# Altium schematic sheet S2_UserInterface.SchDoc
size A4
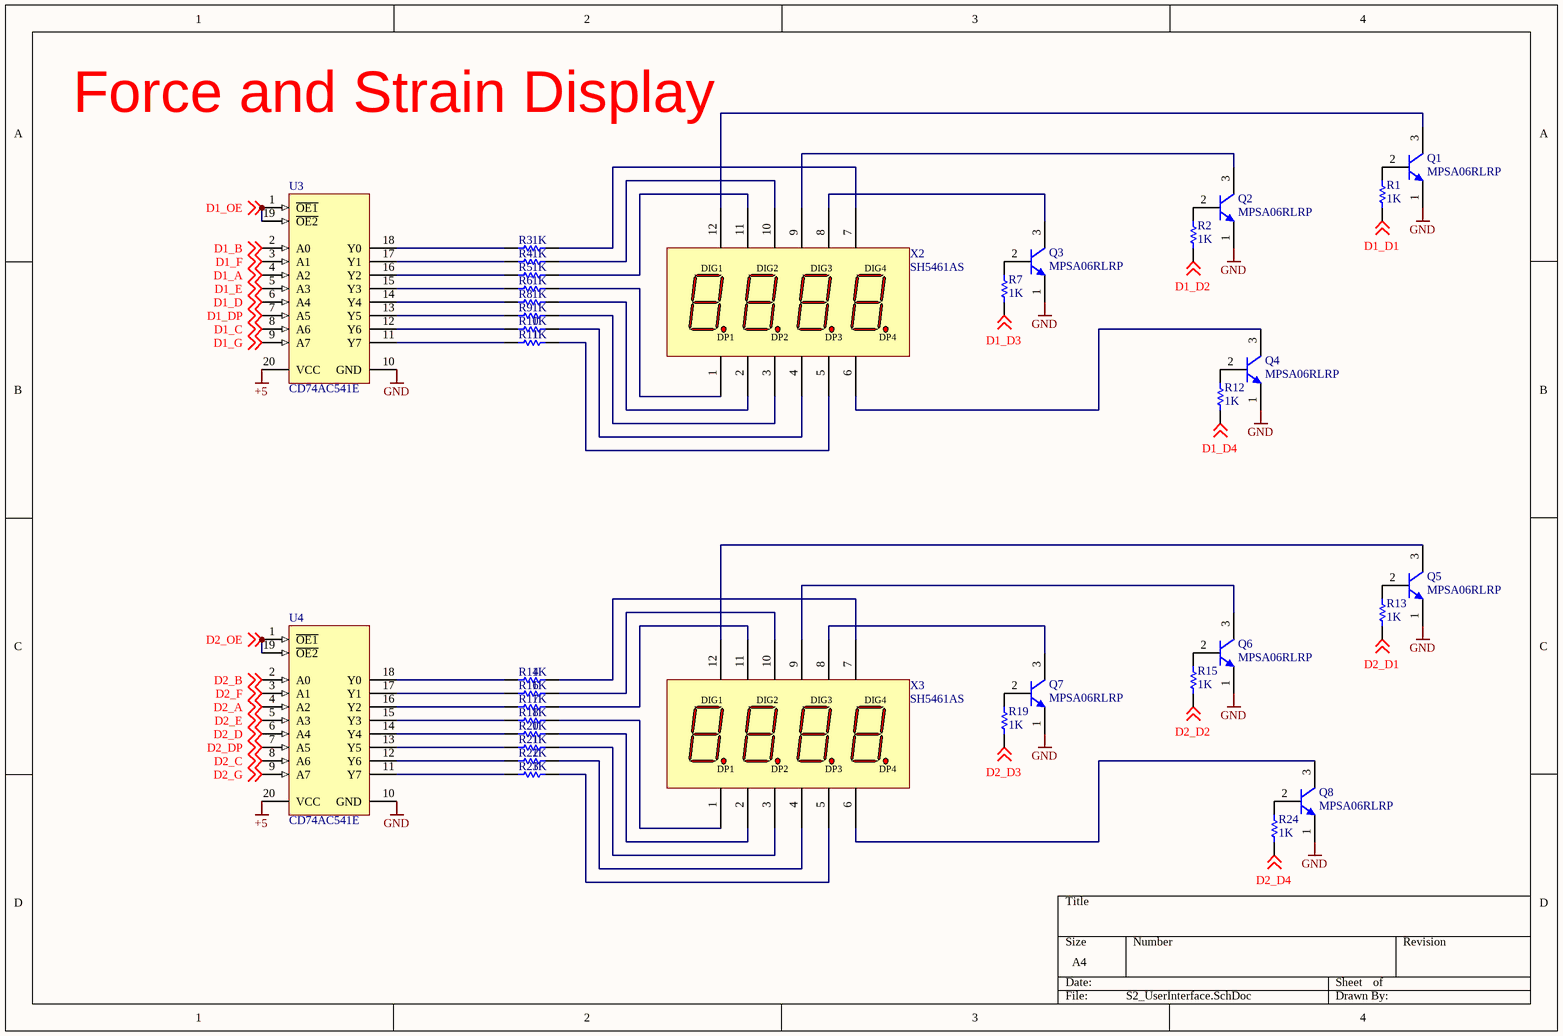
[diagram p0: S2_UserInterface.SchDoc]

## Parts
Q1  MPSA06RLRP  [ONSC-TO-92-3-29-11_AM_BL]
Q2  MPSA06RLRP  [ONSC-TO-92-3-29-11_AM_BL]
Q3  MPSA06RLRP  [ONSC-TO-92-3-29-11_AM_BL]
Q4  MPSA06RLRP  [ONSC-TO-92-3-29-11_AM_BL]
Q5  MPSA06RLRP  [ONSC-TO-92-3-29-11_AM_BL]
Q6  MPSA06RLRP  [ONSC-TO-92-3-29-11_AM_BL]
Q7  MPSA06RLRP  [ONSC-TO-92-3-29-11_AM_BL]
Q8  MPSA06RLRP  [ONSC-TO-92-3-29-11_AM_BL]
R1  value 1K  [AXIAL-0.3-3D]  (hidden comment: Res1)
R2  value 1K  [AXIAL-0.3-3D]  (hidden comment: Res1)
R3  value 1K  [AXIAL-0.3-3D]  (hidden comment: Res1)
R4  value 1K  [AXIAL-0.3-3D]  (hidden comment: Res1)
R5  value 1K  [AXIAL-0.3-3D]  (hidden comment: Res1)
R6  value 1K  [AXIAL-0.3-3D]  (hidden comment: Res1)
R7  value 1K  [AXIAL-0.3-3D]  (hidden comment: Res1)
R8  value 1K  [AXIAL-0.3-3D]  (hidden comment: Res1)
R9  value 1K  [AXIAL-0.3-3D]  (hidden comment: Res1)
R10  value 1K  [AXIAL-0.3-3D]  (hidden comment: Res1)
R11  value 1K  [AXIAL-0.3-3D]  (hidden comment: Res1)
R12  value 1K  [AXIAL-0.3-3D]  (hidden comment: Res1)
R13  value 1K  [AXIAL-0.3-3D]  (hidden comment: Res1)
R14  value 1K  [AXIAL-0.3-3D]  (hidden comment: Res1)
R15  value 1K  [AXIAL-0.3-3D]  (hidden comment: Res1)
R16  value 1K  [AXIAL-0.3-3D]  (hidden comment: Res1)
R17  value 1K  [AXIAL-0.3-3D]  (hidden comment: Res1)
R18  value 1K  [AXIAL-0.3-3D]  (hidden comment: Res1)
R19  value 1K  [AXIAL-0.3-3D]  (hidden comment: Res1)
R20  value 1K  [AXIAL-0.3-3D]  (hidden comment: Res1)
R21  value 1K  [AXIAL-0.3-3D]  (hidden comment: Res1)
R22  value 1K  [AXIAL-0.3-3D]  (hidden comment: Res1)
R23  value 1K  [AXIAL-0.3-3D]  (hidden comment: Res1)
R24  value 1K  [AXIAL-0.3-3D]  (hidden comment: Res1)
U3  CD74AC541E  [N0020A]
U4  CD74AC541E  [N0020A]
X2  SH5461AS  [4x7Seg]
X3  SH5461AS  [4x7Seg]

## Nets
+5: U3.20(VCC) U4.20(VCC)
GND: Q1.1(E) Q2.1(E) Q3.1(E) Q4.1(E) Q5.1(E) Q6.1(E) Q7.1(E) Q8.1(E) U3.10(GND) U4.10(GND)
D1_A: U3.4(A2) ; off-sheet D1_A
D1_B: U3.2(A0) ; off-sheet D1_B
D1_C: U3.8(A6) ; off-sheet D1_C
D1_D: U3.6(A4) ; off-sheet D1_D
D1_D1: R1.1 ; off-sheet D1_D1
D1_D2: R2.1 ; off-sheet D1_D2
D1_D3: R7.1 ; off-sheet D1_D3
D1_D4: R12.1 ; off-sheet D1_D4
D1_DP: U3.7(A5) ; off-sheet D1_DP
D1_E: U3.5(A3) ; off-sheet D1_E
D1_F: U3.3(A1) ; off-sheet D1_F
D1_G: U3.9(A7) ; off-sheet D1_G
D1_OE: U3.1(~{OE1}) U3.19(~{OE2}) ; off-sheet D1_OE
D2_A: U4.4(A2) ; off-sheet D2_A
D2_B: U4.2(A0) ; off-sheet D2_B
D2_C: U4.8(A6) ; off-sheet D2_C
D2_D: U4.6(A4) ; off-sheet D2_D
D2_D1: R13.1 ; off-sheet D2_D1
D2_D2: R15.1 ; off-sheet D2_D2
D2_D3: R19.1 ; off-sheet D2_D3
D2_D4: R24.1 ; off-sheet D2_D4
D2_DP: U4.7(A5) ; off-sheet D2_DP
D2_E: U4.5(A3) ; off-sheet D2_E
D2_F: U4.3(A1) ; off-sheet D2_F
D2_G: U4.9(A7) ; off-sheet D2_G
D2_OE: U4.1(~{OE1}) U4.19(~{OE2}) ; off-sheet D2_OE
NetQ1_2: Q1.2(B) R1.2
NetQ1_3: Q1.3(C) X2.12
NetQ2_2: Q2.2(B) R2.2
NetQ2_3: Q2.3(C) X2.9
NetQ3_2: Q3.2(B) R7.2
NetQ3_3: Q3.3(C) X2.8
NetQ4_2: Q4.2(B) R12.2
NetQ4_3: Q4.3(C) X2.6
NetQ5_2: Q5.2(B) R13.2
NetQ5_3: Q5.3(C) X3.12
NetQ6_2: Q6.2(B) R15.2
NetQ6_3: Q6.3(C) X3.9
NetQ7_2: Q7.2(B) R19.2
NetQ7_3: Q7.3(C) X3.8
NetQ8_2: Q8.2(B) R24.2
NetQ8_3: Q8.3(C) X3.6
NetR3_1: R3.1 X2.7
NetR3_2: R3.2 U3.18(Y0)
NetR4_1: R4.1 X2.10
NetR4_2: R4.2 U3.17(Y1)
NetR5_1: R5.1 X2.11
NetR5_2: R5.2 U3.16(Y2)
NetR6_1: R6.1 X2.1
NetR6_2: R6.2 U3.15(Y3)
NetR8_1: R8.1 X2.2
NetR8_2: R8.2 U3.14(Y4)
NetR9_1: R9.1 X2.3
NetR9_2: R9.2 U3.13(Y5)
NetR10_1: R10.1 X2.4
NetR10_2: R10.2 U3.12(Y6)
NetR11_1: R11.1 X2.5
NetR11_2: R11.2 U3.11(Y7)
NetR14_1: R14.1 X3.7
NetR14_2: R14.2 U4.18(Y0)
NetR16_1: R16.1 X3.10
NetR16_2: R16.2 U4.17(Y1)
NetR17_1: R17.1 X3.11
NetR17_2: R17.2 U4.16(Y2)
NetR18_1: R18.1 X3.1
NetR18_2: R18.2 U4.15(Y3)
NetR20_1: R20.1 X3.2
NetR20_2: R20.2 U4.14(Y4)
NetR21_1: R21.1 X3.3
NetR21_2: R21.2 U4.13(Y5)
NetR22_1: R22.1 X3.4
NetR22_2: R22.2 U4.12(Y6)
NetR23_1: R23.1 X3.5
NetR23_2: R23.2 U4.11(Y7)

## Notes on the sheet
- Force and Strain Display
- (in symbol 4x7Seg) DIG1; DIG2; DIG3; DIG4; DP1; DP2; DP3; DP4

## Library data of the parts
Q1-Q8 = CMP-1048-01505-1: 80 V, 0.5 A, Amplifier Transistor, NPN Transistor, 3-Pin TO-92, Ammo Box; Manufacturer: On Semiconductor; fT Min (MHz): 100; IC Continuous (A): 0.5; Note1: 0; ComponentLink3Description: Package Specification; PackageDescription: 3-Pin Transistor Outline, Body 4.825 x 3.685 mm, Pitch 1.27 mm; DatasheetVersion: Rev. 3; Polarity: NPN; Packing: Ammo Box; PartNumber: MPSA06RLRP; PackageVersion: Rev. AM; ComponentLink2URL: http://www.onsemi.cn/pub_link/Collateral/MPSA05-D.PDF; PackageReference: TO-92-3-29-11_AM_BL; ComponentLink2Description: Datasheet; Mounting Technology: Through Hole; ComponentLink1URL: http://www.onsemi.com/; ComponentLink3URL: http://www.onsemi.com/pub_link/Collateral/MAC97-D.PDF; ComponentLink1Description: Manufacturer URL; RoHS: FALSE
R1-R24 = Res1: Resistor; Published: 8-Jun-2000; LatestRevisionDate: 17-Jul-2002; LatestRevisionNote: Re-released for DXP Platform.; PackageReference: AXIAL-0.3; Publisher: Altium Limited; PackageDescription: Axial Device, Thru-Hole; 2 Leads; 0.3 in Pin Spacing
U3 U4 = CMP-0440-00981-2: Non-Inverting Octal Buffer/Line Drivers with 3-State Outputs, N0020A, TUBE; Manufacturer: Texas Instruments; F @ Nom Voltage(Max)(Mhz): 60; ICC @ Nom Voltage(Max)(mA): 0.16; VCC(Max)(V): 5.5; Rating: Catalog; Voltage(Nom)(V): 1.5,3.3,5; VCC(Min)(V): 1.5; tpd @ Nom Voltage(Max)(ns): 77,8.6,6.2; Output Type: CMOS; Bits(#): 8; Operating Temperature Range(C): -55 to 125; ComponentLink1Description: Manufacturer URL; DatasheetVersion: SCHS285A; Code_JEITA: 5.08; PackageReference: N0020A; ComponentLink2URL: http://www.ti.com/lit/ds/symlink/cd74ac541.pdf; PartNumber: CD74AC541E; ComponentLink2Description: Datasheet; PackageVersion: http://www.ti.com/lit/ml/mpdi002c/mpdi002c.pdf; Generic Part Number: CD74AC541; Input Type: CMOS; Code_IPC: MS-001; ComponentLink1URL: http://www.ti.com/
X2 X3 = 4x7Seg: 4 Character 7 Segment Display, Common Cathode